# Altium schematic sheet motor_controller.SchDoc
size A
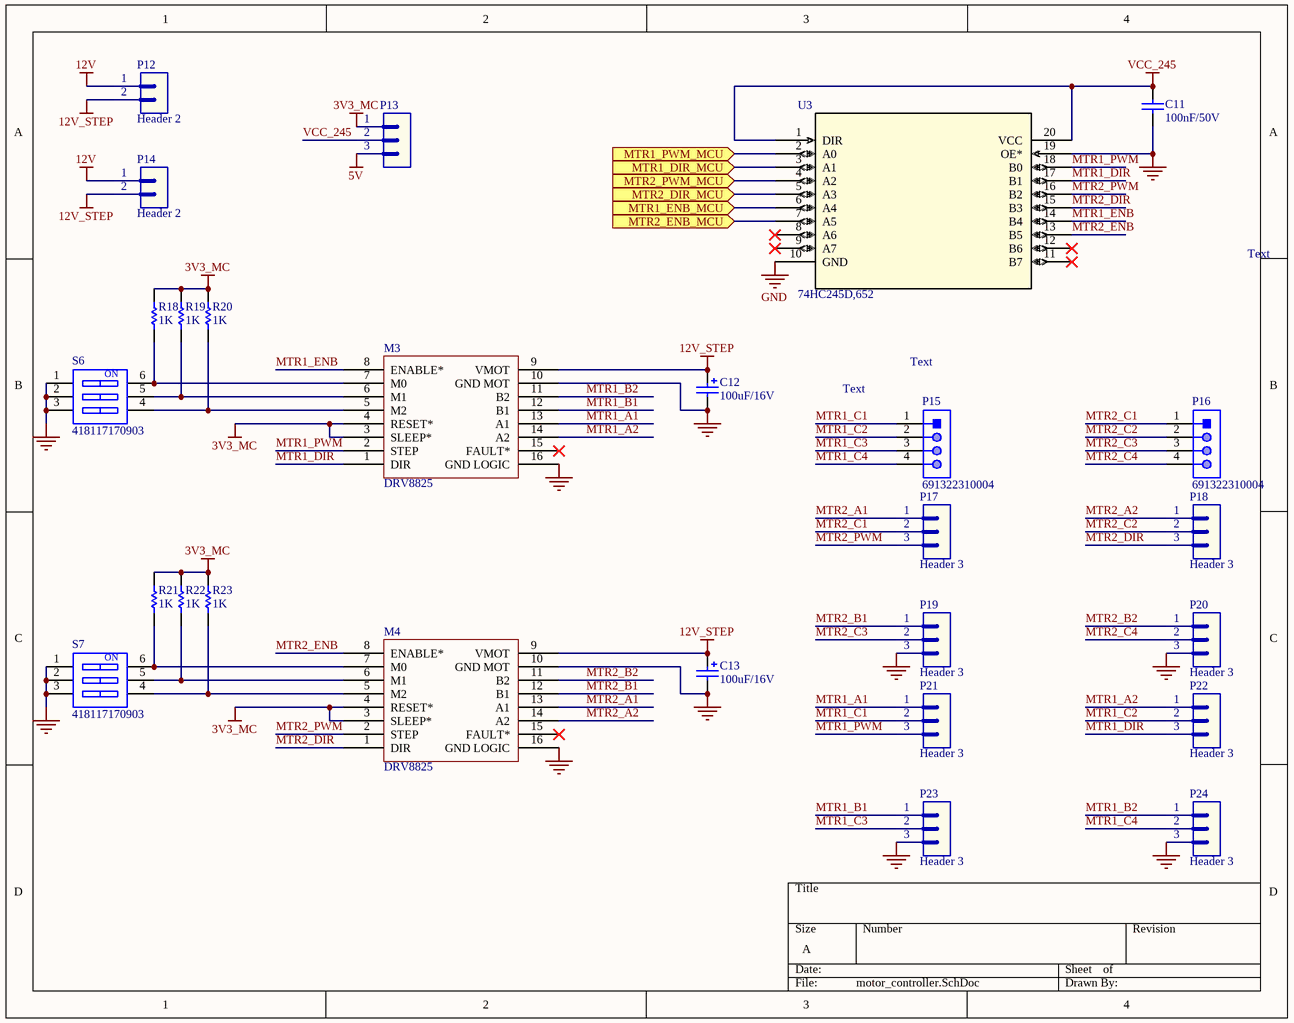
[diagram p0: motor_controller.SchDoc]

## Parts
C11  value 100nF/50V  [CAP-SM-0805]  (hidden comment: Cap-100nF-50V-0805)
C12  value 100uF/16V  [CAP-SM-AL-SIZE-D-D6L6]  (hidden comment: Cap-Al-100uF-16V-D6L5)
C13  value 100uF/16V  [CAP-SM-AL-SIZE-D-D6L6]  (hidden comment: Cap-Al-100uF-16V-D6L5)
M3  DRV8825  [DRV8825]
M4  DRV8825  [DRV8825]
P12  Header 2  [JP2]
P13  Header 3  [JP3]  (value not drawn)
P14  Header 2  [JP2]
P15  691322310004  [691322310004]
P16  691322310004  [691322310004]
P17  Header 3  [JP3]
P18  Header 3  [JP3]
P19  Header 3  [JP3]
P20  Header 3  [JP3]
P21  Header 3  [JP3]
P22  Header 3  [JP3]
P23  Header 3  [JP3]
P24  Header 3  [JP3]
R18  value 1K  [RES-SM-0805]  (hidden comment: Res-1K-0805)
R19  value 1K  [RES-SM-0805]  (hidden comment: Res-1K-0805)
R20  value 1K  [RES-SM-0805]  (hidden comment: Res-1K-0805)
R21  value 1K  [RES-SM-0805]  (hidden comment: Res-1K-0805)
R22  value 1K  [RES-SM-0805]  (hidden comment: Res-1K-0805)
R23  value 1K  [RES-SM-0805]  (hidden comment: Res-1K-0805)
S6  418117170903  [418117170903]
S7  418117170903  [418117170903]
U3  74HC245D,652  [SOT163-1_NEX]

## Ports
MTR1_DIR_MCU (in), MTR1_ENB_MCU (in), MTR1_PWM_MCU (in), MTR2_DIR_MCU (in), MTR2_ENB_MCU (in), MTR2_PWM_MCU (in)

## Nets
3V3_MC: M3.3(SLEEP*) M3.4(RESET*) M4.3(SLEEP*) M4.4(RESET*) P13.1 R18.2 R19.2 R20.2 R21.2 R22.2 R23.2
5V: P13.3
12V: P12.1 P14.1
12V_STEP: C12.1 C13.1 M3.9(VMOT) M4.9(VMOT) P12.2 P14.2
GND: C11.1 C12.2 C13.2 M3.10(GND_MOT) M3.16(GND_LOGIC) M4.10(GND_MOT) M4.16(GND_LOGIC) P19.3 P20.3 P23.3 P24.3 S6.1 S6.2 S6.3 S7.1 S7.2 S7.3 U3.10(GND) U3.19(OE*)
VCC_245: C11.2 P13.2 U3.1(DIR) U3.20(VCC)
MTR1_A1: M3.13(A1) P21.1
MTR1_A2: M3.14(A2) P22.1
MTR1_B1: M3.12(B1) P23.1
MTR1_B2: M3.11(B2) P24.1
MTR1_C1: P15.1 P21.2
MTR1_C2: P15.2 P22.2
MTR1_C3: P15.3 P23.2
MTR1_C4: P15.4 P24.2
MTR1_DIR: M3.1(DIR) P22.3 U3.17(B1)
MTR1_DIR_MCU: U3.3(A1) ; port MTR1_DIR_MCU
MTR1_ENB: M3.8(ENABLE*) U3.14(B4)
MTR1_ENB_MCU: U3.6(A4) ; port MTR1_ENB_MCU
MTR1_PWM: M3.2(STEP) P21.3 U3.18(B0)
MTR1_PWM_MCU: U3.2(A0) ; port MTR1_PWM_MCU
MTR2_A1: M4.13(A1) P17.1
MTR2_A2: M4.14(A2) P18.1
MTR2_B1: M4.12(B1) P19.1
MTR2_B2: M4.11(B2) P20.1
MTR2_C1: P16.1 P17.2
MTR2_C2: P16.2 P18.2
MTR2_C3: P16.3 P19.2
MTR2_C4: P16.4 P20.2
MTR2_DIR: M4.1(DIR) P18.3 U3.15(B3)
MTR2_DIR_MCU: U3.5(A3) ; port MTR2_DIR_MCU
MTR2_ENB: M4.8(ENABLE*) U3.13(B5)
MTR2_ENB_MCU: U3.7(A5) ; port MTR2_ENB_MCU
MTR2_PWM: M4.2(STEP) P17.3 U3.16(B2)
MTR2_PWM_MCU: U3.4(A2) ; port MTR2_PWM_MCU
NetM3_5: M3.5(M2) R20.1 S6.4
NetM3_6: M3.6(M1) R19.1 S6.5
NetM3_7: M3.7(M0) R18.1 S6.6
NetM4_5: M4.5(M2) R23.1 S7.4
NetM4_6: M4.6(M1) R22.1 S7.5
NetM4_7: M4.7(M0) R21.1 S7.6

Not connected (* = marked no-connect by the designer): M3 15(FAULT*)*; M4 15(FAULT*)*; U3 8(A6)* 9(A7)* 11(B7)* 12(B6)*

## Notes on the sheet
- Text
- (in symbol 418117170903) ON

## Library data of the parts
C11 = Cap-100nF-50V-0805: CAP CER 0.1UF 50V Y5V 0805; Manufacturer: Samsung Electro-Mechanics; Manufacturer Part Number: CL21F104ZBCNNNC; Local Supplier: thegioiic; Local Supplier Link: https://thegioiic.com/products/tu-100nf-0-1uf-50v-0805; Supplier 1: Digikey; Supplier 1 Part Number: 1276-1007-1-ND; Supplier 1 Link: https://www.digikey.com/product-detail/en/samsung-electro-mechanics/CL21F104ZBCNNNC/1276-1007-1-ND/3889093
C12 C13 = Cap-Al-100uF-16V-D6L5: CAP ALUM 100UF 20% 16V SMD; Manufacturer: Nichicon; Manufacturer Part Number: UWX1C101MCL1GB; Local Supplier: thegioiic; Local Supplier Link: https://thegioiic.com/products/tu-nhom-smd-100uf-16v-d6-3l5-4; Supplier 1: Digikey; Supplier 1 Part Number: 493-2105-1-ND; Supplier 1 Link: https://www.digikey.com/product-detail/en/nichicon/UWX1C101MCL1GB/493-2105-1-ND/590080
P12 P14 = Header 2: Header, 2-Pin; LatestRevisionDate: 17-Jul-2002; LatestRevisionNote: Re-released for DXP Platform.; Publisher: Altium Limited
P13 P17-P24 = Header 3: Header, 3-Pin; LatestRevisionDate: 17-Jul-2002; LatestRevisionNote: Re-released for DXP Platform.; Publisher: Altium Limited
P15 P16 = 691322310004: WR-TBL Serie 322 Horizontal PCB Header, Pluggable, pitch 3.81mm, 4p; Compliance: RoHS; Modularity: No; Pin Number: 4; Rated Current [UL]: 10A; Working Voltage [UL]: 300VAC; ComponentLink1Description: Manufacturer; ComponentLink1URL: http://www.we-online.de; ComponentLink2URL: https://katalog.we-online.de/em/datasheet/691322310004.pdf; ComponentLink2Description: Datasheet; Mounting Technology: THT; Part Number: 691322310004; Packaging: Box; Operating Temperature: -40 to +105degC; PCB/Cable/Panel: PCB; Pitch: 3.81mm; Published Date: October 2019; Type: Horizontal; Publisher: Wurth Elektronik; Application: Pluggable
R18-R23 = Res-1K-0805: RES 1K OHM 1% 1/4W 0805; Manufacturer: Stackpole Electronics Inc; Manufacturer Part Number: RNCP0805FTD1K00; Local Supplier: thegioiic; Local Supplier Link: https://thegioiic.com/products/dien-tro-1k-ohm-0805-5; Supplier 1: Digikey; Supplier 1 Link: https://www.digikey.com/product-detail/en/stackpole-electronics-inc/RNCP0805FTD1K00/RNCP0805FTD1K00CT-ND/2240568; Supplier 1 Part Number: RNCP0805FTD1K00CT-ND
S6 S7 = 418117170903: WS-DITV Compact THT Dip Switch, Flat Actuator, pitch 2.54mm, 3p; Operation Force: 800g; Pole Number: 3; Actuator Type: Flat Type; Circuit: SPST-NO; Rated Current Switching: 25mA; Rated Current Non-Switching: 100mA; Rated Voltage Non-Switching: 50VDC; Rated Voltage Switching: 24VDC; ComponentLink1Description: Manufacturer; ComponentLink1URL: http://www.we-online.de; ComponentLink2Description: Datasheet; ComponentLink2URL: https://katalog.we-online.com/em/datasheet/418117170903.pdf; Pitch: 2.54mm; Contact Material: Copper Alloy; Mounting Technology: THT; Operating Temperature: -40 to +85degC; Contact Plating: Gold; Packaging: Tube; Part Number: 418117170903; Publisher: Wurth Elektronik; Published Date: September 2019
U3 = 74HC245D,652: No Description Available; Vendor: Nexperia; SourceLibrary: Nexperia_2018-05-2018; Manufacturer_Part_Number: 74HC245D,652; Copyright: Copyright (C) 2016 Accelerated Designs. All rights reserved; RefDes: RefDes; Type: DEV